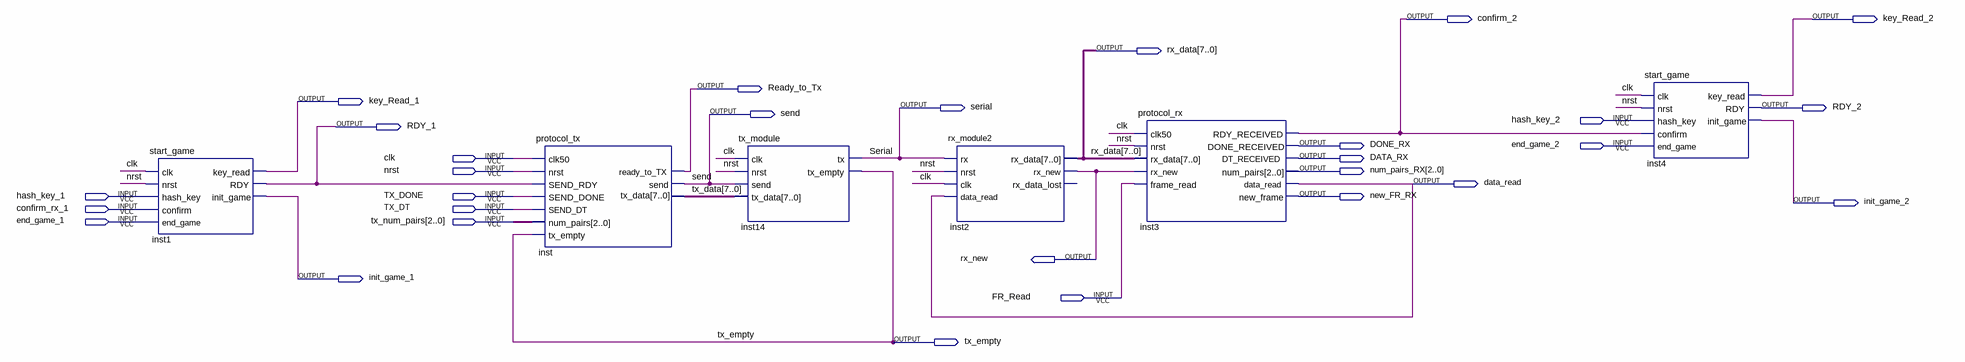
[diagram p0: schematic sheet]
// Quartus schematic communication_sim_with_start.bdf as structural Verilog: 6 symbols, 29 pins
module communication_sim_with_start (
  input  hash_key_2,
  input  end_game_2,
  input  clk,
  input  nrst,
  input  hash_key_1,
  input  TX_DONE,
  input  confirm_rx_1,
  input  TX_DT,
  input  end_game_1,
  input  [2:0] tx_num_pairs,
  input  FR_Read,
  output confirm_2,
  output key_Read_2,
  output [7:0] rx_data,
  output Ready_to_Tx,
  output key_Read_1,
  output serial,
  output RDY_2,
  output send,
  output RDY_1,
  output DONE_RX,
  output DATA_RX,
  output [2:0] num_pairs_RX,
  output data_read,
  output new_FR_RX,
  output init_game_2,
  output rx_new,
  output init_game_1,
  output tx_empty
);

  wire [7:0] tx_data;

  start_game inst1 (
    .clk(clk), .nrst(nrst), .hash_key(hash_key_1), .confirm(confirm_rx_1), .end_game(end_game_1),
    .key_read(key_Read_1), .RDY(RDY_1), .init_game(init_game_1));
  protocol_tx inst (
    .clk50(clk), .nrst(nrst), .SEND_RDY(RDY_1), .SEND_DONE(TX_DONE), .SEND_DT(TX_DT),
    .num_pairs(tx_num_pairs), .tx_empty(tx_empty), .tx_data(tx_data), .ready_to_TX(Ready_to_Tx), .send(send));
  tx_module inst14 (.clk(clk), .nrst(nrst), .send(send), .tx_data(tx_data), .tx(serial), .tx_empty(tx_empty));
  rx_module2 inst2 (
    .clk(clk), .nrst(nrst), .rx(serial), .data_read(data_read), .rx_data(rx_data), .rx_new(rx_new));  // open: rx_data_lost
  protocol_rx inst3 (
    .clk50(clk), .nrst(nrst), .rx_data(rx_data), .rx_new(rx_new), .frame_read(FR_Read),
    .RDY_RECEIVED(confirm_2), .DONE_RECEIVED(DONE_RX), .DT_RECEIVED(DATA_RX), .num_pairs(num_pairs_RX),
    .data_read(data_read), .new_frame(new_FR_RX));
  start_game inst4 (
    .clk(clk), .nrst(nrst), .hash_key(hash_key_2), .confirm(confirm_2), .end_game(end_game_2),
    .key_read(key_Read_2), .RDY(RDY_2), .init_game(init_game_2));
endmodule
